# Altium project MY26 HV Inverter Logic Board.PrjPcb (part 3 of 3)

## Sheet PeripheralConnector.SchDoc
size A; SheetNumber: 12; SheetTotal: 15
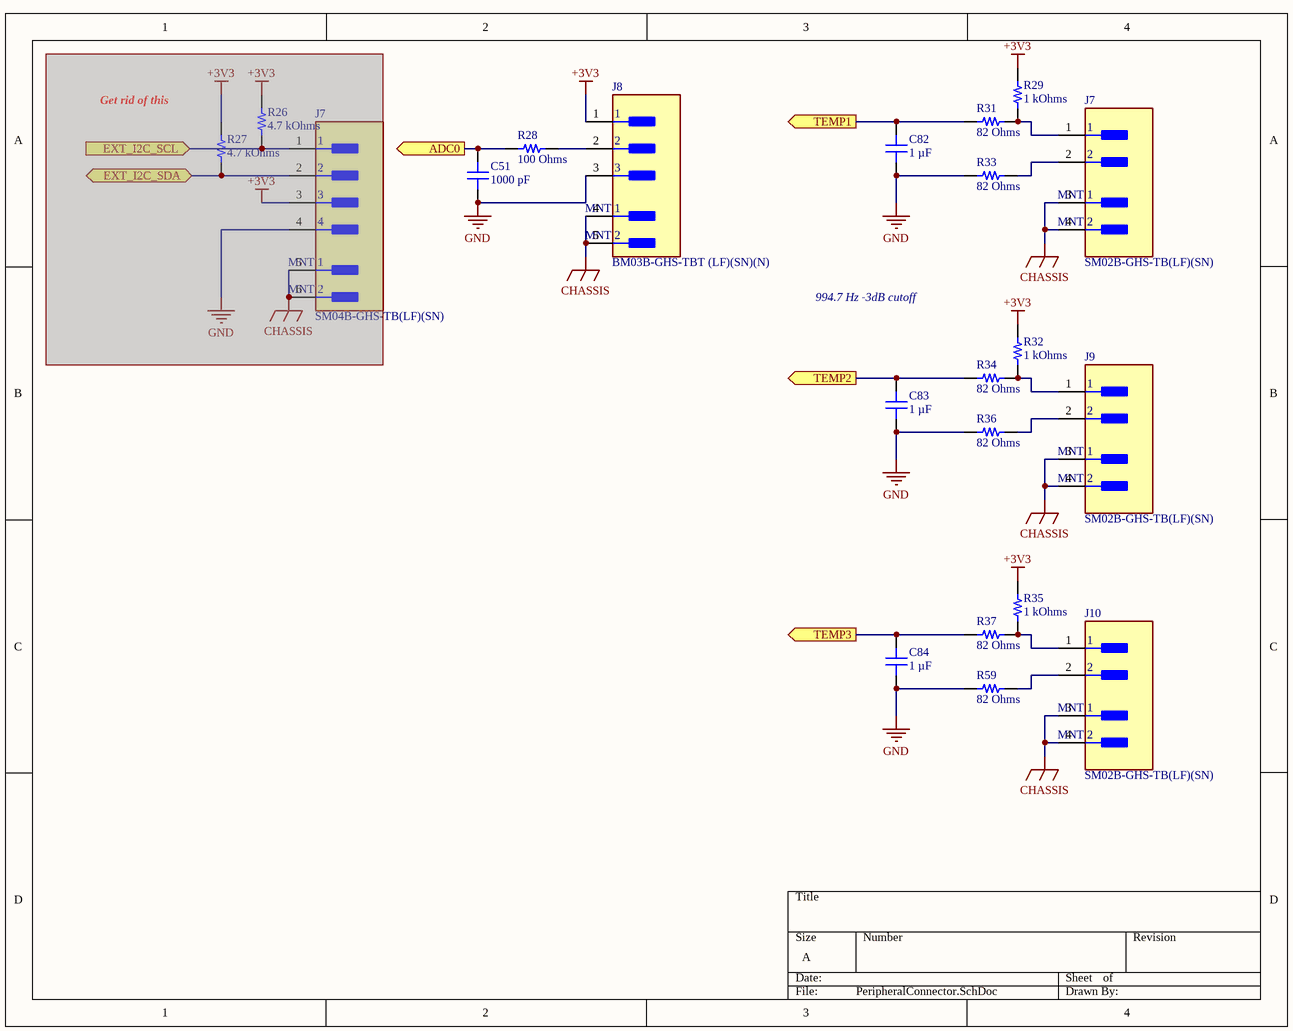
[diagram p10: PeripheralConnector.SchDoc]

### Parts
(Parts that share a designator on the sheet are numbered #1, #2 ... from top to bottom, then left to right.)
C51  1000 pF  [CAP 0402_1005]
C82  1 µF  [CAP 0402_1005]
C83  1 µF  [CAP 0402_1005]
C84  1 µF  [CAP 0402_1005]
J7#1  SM02B-GHS-TB(LF)(SN)  [FP-SM02B-GHS-TB_LF_SN-MFG]
J7#2  SM04B-GHS-TB(LF)(SN)  [FP-SM04B-GHS-TB_LF_SN-MFG]  (masked out: inside a compile mask, not in the netlist)
J8  BM03B-GHS-TBT (LF)(SN)(N)  [FP-BM03B-GHS-TBT_LF_SN-MFG]
J9  SM02B-GHS-TB(LF)(SN)  [FP-SM02B-GHS-TB_LF_SN-MFG]
J10  SM02B-GHS-TB(LF)(SN)  [FP-SM02B-GHS-TB_LF_SN-MFG]
R26#2  4.7 kOhms  [RES 0402_1005]  (masked out: inside a compile mask, not in the netlist)
R27#2  4.7 kOhms  [RES 0402_1005]  (masked out: inside a compile mask, not in the netlist)
R28  100 Ohms  [RES 0402_1005]
R29  1 kOhms  [RES 0402_1005]
R31  82 Ohms  [RES 0402_1005]
R32  1 kOhms  [RES 0402_1005]
R33  82 Ohms  [RES 0402_1005]
R34  82 Ohms  [RES 0402_1005]
R35  1 kOhms  [RES 0402_1005]
R36  82 Ohms  [RES 0402_1005]
R37  82 Ohms  [RES 0402_1005]
R59  82 Ohms  [RES 0402_1005]

### Ports
ADC0 (out), EXT_I2C_SCL (in), EXT_I2C_SDA (bidir), TEMP1 (out), TEMP2 (out), TEMP3 (out)

### Nets
+3V3: J8.1 R29.2 R32.2 R35.2
CHASSIS: J7#1.3(MNT_1) J7#1.4(MNT_2) J8.4(MNT_1) J8.5(MNT_2) J9.3(MNT_1) J9.4(MNT_2) J10.3(MNT_1) J10.4(MNT_2)
GND: C51.1 C82.1 C83.1 C84.1 J8.3 R33.1 R36.1 R59.1
ADC0: C51.2 R28.1 ; port ADC0
TEMP1: C82.2 R31.1 ; port TEMP1
TEMP2: C83.2 R34.1 ; port TEMP2
TEMP3: C84.2 R37.1 ; port TEMP3
NetJ7#1_1: J7#1.1 R29.1 R31.2
NetJ7#1_2: J7#1.2 R33.2
NetJ8_2: J8.2 R28.2
NetJ9_1: J9.1 R32.1 R34.2
NetJ9_2: J9.2 R36.2
NetJ10_1: J10.1 R35.1 R37.2
NetJ10_2: J10.2 R59.2

### Notes on the sheet
- (near R27#2) Get rid of this
- 994.7 Hz -3dB cutoff

### Library data of the parts
C51 = UMK105CG102JVHF: CAP CER 1000PF 50V C0G/NP0 0402; manufacturer: Taiyo Yuden; Temperature Coefficient: C0G, NP0; Tolerance: ±5%; Part Number: UMK105CG102JVHF; Capacitance: 1000 pF; Applications: Automotive; componentlink1description: Datasheet; componentlink1url: https://ds.yuden.co.jp/TYCOMPAS/ut/detail?pn=UMK105CG102JVHF &u=M; componentlink2description: DigiKey Link; componentlink2url: https://www.digikey.com/en/products/detail/taiyo-yuden/UMK105CG102JVHF/4811103; Device Package: 0402 (1005 Metric); lastupdated: 2/9/2024 8:04:38 PM; Lifecycle Status: Active; Minimum Order: 1; Mounting Type: Surface Mount, MLCC; Operating Temperature: -55°C ~ 125°C; Package / Case: 0402 (1005 Metric); packaging: TapeAndReel; partid: 1779; Part Status: Active; price: 0.01; Ratings: AEC-Q200; series: M; Size / Dimension: 0.039" L x 0.020" W (1.00mm x 0.50mm); Supplier 1: DigiKey; Supplier Part Number 1: 587-3737-1-ND; Thickness (Max): 0.022" (0.55mm); value: 1000 pF; Voltage - Rated: 50V
C82-C84 = 0402BW105K160NGT: CAP CER 1UF 16V X5R 0402; manufacturer: Knowles Novacap; Tolerance: ±10%; Part Number: 0402BW105K160NGT; Capacitance: 1 µF; Applications: General Purpose; componentlink1description: Datasheet; componentlink1url: https://www.knowlescapacitors.com/getattachment/6c8d48ef-fc2b-4752-ae2c-ce6c208de0c4/High-Capacitance-Chip.aspx; componentlink2description: DigiKey Link; componentlink2url: https://www.digikey.com/en/products/detail/knowles-novacap/0402BW105K160NGT/7304075; Device Package: 0402 (1005 Metric); Features: Gold Flash Termination; lastupdated: 2/9/2024 8:04:33 PM; Lifecycle Status: Active; Minimum Order: 1; Mounting Type: Surface Mount, MLCC; Operating Temperature: -55°C ~ 85°C; Package / Case: 0402 (1005 Metric); packaging: TapeAndReel; partid: 4314; Part Status: Active; price: 1.00; series: -; Size / Dimension: 0.040" L x 0.020" W (1.02mm x 0.51mm); Supplier 1: DigiKey; Supplier Part Number 1: 1763-1163-1-ND; Temperature Coefficient: X5R; Thickness (Max): 0.024" (0.61mm); value: 1 µF; Voltage - Rated: 16V
J7#1 J9 J10 = CMP-2000-07076-2: CONN HEADER SMD R/A 2POS 1.25MM; Voltage Rating: 50V; Number of Positions: 2; Pitch: 0.049inch; Current Rating: 1A; Connector Type: Outer Shroud Contact; Number of Rows: 1; Contact Material: Bronze; Termination: Solder; Color: Natural; Package Quantity: 2500; Mount: Surface Mount; Housing Color: Natural; Number of Contacts: 2; Packaging: Tape and Reel; Lead Free: Lead Free; Housing Material: Nylon; Orientation: Right Angle; Contact Type: Male Pin; Contact Plating: Tin; Series: GH; Fastening Type: Latch
J7#2 = CMP-17439-000411-1: CONN HEADER SMD R/A 4POS 1.25MM; Voltage Rating: 50V; Number of Contacts: 4; Current Rating: 1A; Termination: Solder; Mount: Surface Mount; REACH SVHC: No SVHC; Packaging: Cut Tape; Contact Material: Bronze; Series: GH; Orientation: Right Angle; Lead Free: Lead Free; Housing Material: Nylon; Contact Plating: Tin; Housing Color: Natural; Number of Rows: 1; Pitch: 1.25mm; Number of Positions: 4
J8 = CMP-17439-000616-1: CONN HEADER SMD 3POS 1.25MM; Mated Stacking Heights: 7.3mm; Voltage Rating: 50V; Pitch: 0.049inch; Number of Positions: 3; Contact Material: Bronze; Number of Rows: 1; Packaging: Cut Tape; Fastening Type: Ramp; Contact Shape: Rectangular; Termination: Solder; Flammability Rating: UL94 V-0; Lead Free: Lead Free; Color: Natural; Mount: Surface Mount; Contact Finish - Mating: TIN; Max Operating Temperature: 85°C; Series: GH; Insulation Color: Natural; Connector Type: Header; Insulation Material: Nylon; Contact Type: Outer Shroud Contact; Min Operating Temperature: -25°C; Contact Plating: Tin
R26#2 R27#2 = WR04X4701FTL: RES 4.7K OHM 1% 1/16W 0402; Manufacturer: Walsin Technology Corporation; Power (Watts): 0.063W, 1/16W; Temperature Coefficient: ±100ppm/°C; Part Number: WR04X4701FTL; Value: 4.7 kOhms; ComponentLink1Description: Datasheet; ComponentLink1URL: https://www.passivecomponent.com/wp-content/uploads/chipR/ASC_WR.pdf; ComponentLink2Description: DigiKey Link; ComponentLink2URL: https://www.digikey.com/en/products/detail/walsin-technology-corporation/WR04X4701FTL/13239186; Composition: Thick Film; Device Package: 0402 (1005 Metric); Height - Seated (Max): 0.016" (0.40mm); LastUpdated: 2/9/2024 8:28:34 PM; Lifecycle Status: Active; Minimum Order: 1; Number of Terminations: 2; Operating Temperature: -55°C ~ 155°C; Package / Case: 0402 (1005 Metric); Packaging: CutTape; PartId: 77487; Part Status: Active; Price: 0.01; Resistance: 4.7 kOhms; Series: WR; Size / Dimension: 0.039" L x 0.020" W (1.00mm x 0.50mm); Supplier 1: DigiKey; Supplier Part Number 1: 1292-WR04X4701FTLCT-ND; Supplier Device Package: 0402; Tolerance: ±1%
R28 = WR04X1000FTL: RES 100 OHM 1% 1/16W 0402; Manufacturer: Walsin Technology Corporation; Power (Watts): 0.063W, 1/16W; Temperature Coefficient: ±100ppm/°C; Part Number: WR04X1000FTL; Value: 100 Ohms; ComponentLink1Description: Datasheet; ComponentLink1URL: https://www.passivecomponent.com/wp-content/uploads/chipR/ASC_WR.pdf; ComponentLink2Description: DigiKey Link; ComponentLink2URL: https://www.digikey.com/en/products/detail/walsin-technology-corporation/WR04X1000FTL/13241075; Composition: Thick Film; Device Package: 0402 (1005 Metric); Height - Seated (Max): 0.016" (0.40mm); LastUpdated: 2/9/2024 8:28:55 PM; Lifecycle Status: Active; Minimum Order: 1; Number of Terminations: 2; Operating Temperature: -55°C ~ 155°C; Package / Case: 0402 (1005 Metric); Packaging: CutTape; PartId: 64787; Part Status: Active; Price: 0.01; Resistance: 100 Ohms; Series: WR; Size / Dimension: 0.039" L x 0.020" W (1.00mm x 0.50mm); Supplier 1: DigiKey; Supplier Part Number 1: 1292-WR04X1000FTLCT-ND; Supplier Device Package: 0402; Tolerance: ±1%
R29 R32 R35 = WR04X1001FTL: RES 1K OHM 1% 1/16W 0402; Manufacturer: Walsin Technology Corporation; Power (Watts): 0.063W, 1/16W; Temperature Coefficient: ±100ppm/°C; Part Number: WR04X1001FTL; Value: 1 kOhms; ComponentLink1Description: Datasheet; ComponentLink1URL: https://www.passivecomponent.com/wp-content/uploads/chipR/ASC_WR.pdf; ComponentLink2Description: DigiKey Link; ComponentLink2URL: https://www.digikey.com/en/products/detail/walsin-technology-corporation/WR04X1001FTL/13240628; Composition: Thick Film; Device Package: 0402 (1005 Metric); Height - Seated (Max): 0.016" (0.40mm); LastUpdated: 2/9/2024 8:28:55 PM; Lifecycle Status: Active; Minimum Order: 1; Number of Terminations: 2; Operating Temperature: -55°C ~ 155°C; Package / Case: 0402 (1005 Metric); Packaging: CutTape; PartId: 64768; Part Status: Active; Price: 0.01; Resistance: 1 kOhms; Series: WR; Size / Dimension: 0.039" L x 0.020" W (1.00mm x 0.50mm); Supplier 1: DigiKey; Supplier Part Number 1: 1292-WR04X1001FTLCT-ND; Supplier Device Package: 0402; Tolerance: ±1%
R31 R33 R34 R36 R37 R59 = ERJ-2GEJ820X: RES SMD 82 OHM 5% 1/10W 0402; Manufacturer: Panasonic Electronic Components; Power (Watts): 0.1W, 1/10W; Temperature Coefficient: ±200ppm/°C; Part Number: ERJ-2GEJ820X; Value: 82 Ohms; ComponentLink1Description: Datasheet; ComponentLink1URL: https://b2b-api.panasonic.eu/file_stream/pids/fileversion/1242; ComponentLink2Description: DigiKey Link; ComponentLink2URL: https://www.digikey.com/en/products/detail/panasonic-electronic-components/ERJ-2GEJ820X/147082; Composition: Thick Film; Device Package: 0402 (1005 Metric); Features: Automotive AEC-Q200; Height - Seated (Max): 0.016" (0.40mm); LastUpdated: 2/9/2024 8:30:20 PM; Lifecycle Status: Active; Minimum Order: 1; Number of Terminations: 2; Operating Temperature: -55°C ~ 155°C; Package / Case: 0402 (1005 Metric); Packaging: CutTape; PartId: 3514; Part Status: Active; Price: 0.01; Ratings: AEC-Q200; Resistance: 82 Ohms; Series: ERJ-2G; Size / Dimension: 0.039" L x 0.020" W (1.00mm x 0.50mm); Supplier 1: DigiKey; Supplier Part Number 1: P82JCT-ND; Supplier Device Package: 0402; Tolerance: ±5%

## Sheet EXTADC.SchDoc
size A; SheetNumber: 13; SheetTotal: 15
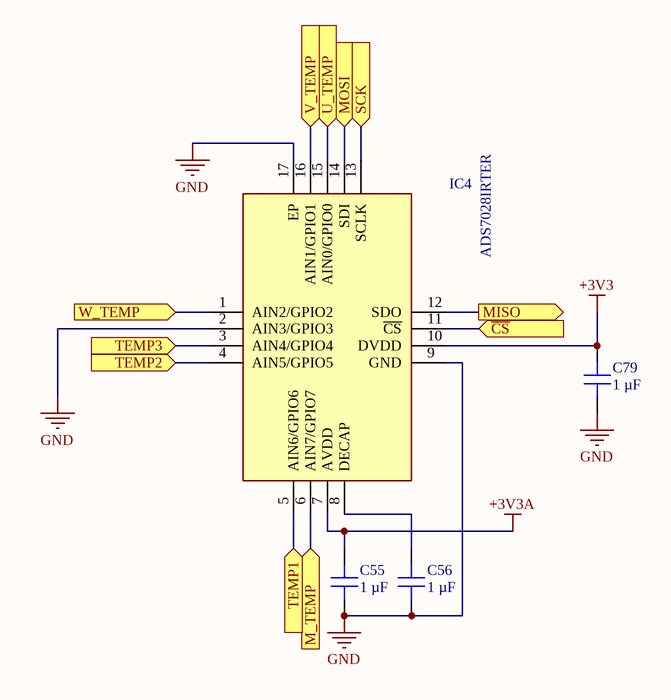
[diagram p11: EXTADC.SchDoc]

### Parts
C55  1 µF  [MURATA GRM155 0402_1005]
C56  1 µF  [MURATA GRM155 0402_1005]
C79  1 µF  [MURATA GRM155 0402_1005]
IC4  ADS7028IRTER  [QFN50P300X300X80-17N-D]

### Ports
M_TEMP (in), MISO (out), MOSI (in), SCK (in), TEMP1 (in), TEMP2 (in), TEMP3 (in), U_TEMP (in), V_TEMP (in), W_TEMP (in), ~{CS} (in)

### Nets
+3V3: C79.2 IC4.10(DVDD)
+3V3A: C55.2 IC4.7(AVDD)
GND: C55.1 C56.1 C79.1 IC4.2(AIN3/GPIO3) IC4.9(GND) IC4.17(EP)
ADC_CLK: IC4.13(SCLK) ; port SCK
ADC_CS: IC4.11(~{CS}) ; port ~{CS}
ADC_MISO: IC4.12(SDO) ; port MISO
ADC_MOSI: IC4.14(SDI) ; port MOSI
M_TEMP: IC4.6(AIN7/GPIO7) ; port M_TEMP
TEMP1: IC4.5(AIN6/GPIO6) ; port TEMP1
TEMP2: IC4.4(AIN5/GPIO5) ; port TEMP2
TEMP3: IC4.3(AIN4/GPIO4) ; port TEMP3
U_TEMP: IC4.15(AIN0/GPIO0) ; port U_TEMP
V_TEMP: IC4.16(AIN1/GPIO1) ; port V_TEMP
W_TEMP: IC4.1(AIN2/GPIO2) ; port W_TEMP
NetC56_2: C56.2 IC4.8(DECAP)

### Library data of the parts
C55 C56 C79 = GRM155C71A105KE11D: CAP CER 1UF 10V X7S 0402; manufacturer: Murata Electronics; Tolerance: ±10%; Part Number: GRM155C71A105KE11D; Capacitance: 1 µF; Applications: General Purpose; componentlink1description: Datasheet; componentlink1url: https://search.murata.co.jp/Ceramy/image/img/A01X/G101/ENG/GRM155C71A105KE11-01.pdf; componentlink2description: DigiKey Link; componentlink2url: https://www.digikey.com/en/products/detail/murata-electronics/GRM155C71A105KE11D/6606086; Device Package: 0402 (1005 Metric); lastupdated: 7/23/2025 10:42:36 AM; Lifecycle Status: Active; Minimum Order: 1; Mounting Type: Surface Mount, MLCC; Operating Temperature: -55°C ~ 125°C; Package / Case: 0402 (1005 Metric); packaging: TapeAndReel; partid: 1749; Part Status: Active; price: 0.01; series: GRM; Size / Dimension: 0.039" L x 0.020" W (1.00mm x 0.50mm); Supplier 1: DigiKey; Supplier Part Number 1: 490-14457-1-ND; Temperature Coefficient: X7S; Thickness (Max): 0.024" (0.60mm); value: 1 µF; Voltage - Rated: 10V
IC4 = ADS7028IRTER: Integrated Circuit; Manufacturer_Name: Texas Instruments; Datasheet Link: https://www.arrow.com/en/products/ads7028irter/texas-instruments; Height: 0.8mm; Manufacturer_Part_Number: ADS7028IRTER; Mouser Part Number: 595-ADS7028IRTER; Mouser Price/Stock: https://www.mouser.co.uk/ProductDetail/Texas-Instruments/ADS7028IRTER?qs=%252B6g0mu59x7L0mzHBJBWvJw%3D%3D; Arrow Part Number: ADS7028IRTER; Arrow Price/Stock: https://www.arrow.com/en/products/ads7028irter/texas-instruments

## Sheet EnDat.SchDoc
size A; SheetNumber: 11; SheetTotal: 15
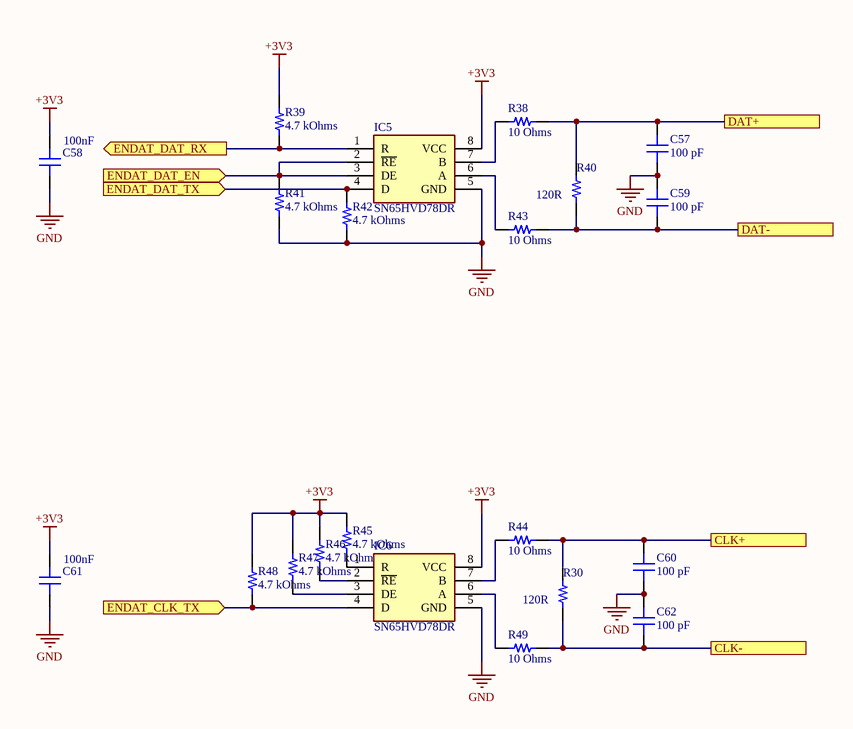
[diagram p12: EnDat.SchDoc]

### Parts
C57  100 pF  [CAP 0402_1005]
C58  100nF  [CAP 0402_1005]
C59  100 pF  [CAP 0402_1005]
C60  100 pF  [CAP 0402_1005]
C61  100nF  [CAP 0402_1005]
C62  100 pF  [CAP 0402_1005]
IC5  SN65HVD78DR  [SOIC127P600X175-8N]
IC6  SN65HVD78DR  [SOIC127P600X175-8N]
R30  120R  [RES 0603_1608]
R38  10 Ohms  [RES 0402_1005]
R39  4.7 kOhms  [RES 0402_1005]
R40  120R  [RES 0603_1608]
R41  4.7 kOhms  [RES 0402_1005]
R42  4.7 kOhms  [RES 0402_1005]
R43  10 Ohms  [RES 0402_1005]
R44  10 Ohms  [RES 0402_1005]
R45  4.7 kOhms  [RES 0402_1005]
R46  4.7 kOhms  [RES 0402_1005]
R47  4.7 kOhms  [RES 0402_1005]
R48  4.7 kOhms  [RES 0402_1005]
R49  10 Ohms  [RES 0402_1005]

### Ports
CLK+, CLK-, DAT+, DAT-, ENDAT_CLK_TX (in), ENDAT_DAT_EN (in), ENDAT_DAT_RX (out), ENDAT_DAT_TX (in)

### Nets
+3V3: C58.2 C61.2 IC5.8(VCC) IC6.8(VCC) R39.2 R45.2 R46.2 R47.2 R48.2
GND: C57.1 C58.1 C59.2 C60.1 C61.1 C62.2 IC5.5(GND) IC6.5(GND) R41.1 R42.1
CLK+: C60.2 R30.2 R44.2 ; port CLK+
CLK-: C62.1 R30.1 R49.2 ; port CLK-
DAT+: C57.2 R38.2 R40.2 ; port DAT+
DAT-: C59.1 R40.1 R43.2 ; port DAT-
ENC_CLK: IC6.4(D) R48.1 ; port ENDAT_CLK_TX
ENC_ENDAT: IC5.2(~{RE}) IC5.3(DE) R41.2 ; port ENDAT_DAT_EN
ENC_MISO: IC5.1(R) R39.1 ; port ENDAT_DAT_RX
ENC_MOSI: IC5.4(D) R42.2 ; port ENDAT_DAT_TX
NetIC5_6: IC5.6(A) R43.1
NetIC5_7: IC5.7(B) R38.1
NetIC6_1: IC6.1(R) R45.1
NetIC6_2: IC6.2(~{RE}) R46.1
NetIC6_3: IC6.3(DE) R47.1
NetIC6_6: IC6.6(A) R49.1
NetIC6_7: IC6.7(B) R44.1

### Library data of the parts
C57 C59 C60 C62 = 500X07N101MV4T: CAP CER 100PF 50V C0G/NP0 0402; manufacturer: Johanson Dielectrics Inc.; Temperature Coefficient: C0G, NP0; Tolerance: ±20%; Part Number: 500X07N101MV4T; Capacitance: 100 pF; Applications: Bypass, Decoupling; componentlink1description: Datasheet; componentlink1url: https://www.johansondielectrics.com/downloads/x2y-filter-and-decoupling-capacitors.pdf; componentlink2description: DigiKey Link; componentlink2url: https://www.digikey.com/en/products/detail/johanson-dielectrics-inc/500X07N101MV4T/2046917; Device Package: 0402 (1005 Metric); Features: Low ESL (X2Y); lastupdated: 2/9/2024 8:04:38 PM; Lifecycle Status: Active; Minimum Order: 1; Mounting Type: Surface Mount, MLCC; Operating Temperature: -55°C ~ 125°C; Package / Case: 0402 (1005 Metric); packaging: TapeAndReel; partid: 1767; Part Status: Active; price: 0.08; series: X2Y®; Size / Dimension: 0.045" L x 0.025" W (1.14mm x 0.64mm); Supplier 1: DigiKey; Supplier Part Number 1: 709-1214-1-ND; Thickness (Max): 0.020" (0.51mm); value: 100 pF; Voltage - Rated: 50V
C58 C61 = CL05A105KO5NNNC: CAP CER 1UF 16V X5R 0402; Part Number: C29266; manufacturer: Samsung Electro-Mechanics; Capacitance: 10uF; Tolerance: ±10%; value: 1 µF; Applications: General Purpose; componentlink1description: Datasheet; componentlink1url: http://www.samsungsem.com/kr/support/product-search/mlcc/CL05A105KO5NNNC.jsp; componentlink2description: DigiKey Link; componentlink2url: https://www.digikey.com/en/products/detail/samsung-electro-mechanics/CL05A105KO5NNNC/3886725; Device Package: 0402 (1005 Metric); lastupdated: 2/9/2024 8:04:35 PM; Lifecycle Status: Active; Minimum Order: 1; Mounting Type: Surface Mount, MLCC; Operating Temperature: -55°C ~ 85°C; Package / Case: 0402 (1005 Metric); packaging: TapeAndReel; partid: 3120; Part Status: Active; price: 0.01; series: CL; Size / Dimension: 0.039" L x 0.020" W (1.00mm x 0.50mm); Supplier 1: DigiKey; Supplier Part Number 1: 1276-1067-1-ND; Temperature Coefficient: X5R; Thickness (Max): 0.022" (0.55mm); Voltage - Rated: 16V
IC5 IC6 = SN65HVD78DR: Integrated Circuit; Manufacturer_Name: Texas Instruments; Datasheet Link: http://www.ti.com/lit/gpn/sn65hvd78; Height: 1.75mm; Manufacturer_Part_Number: SN65HVD78DR; Mouser Part Number: 595-SN65HVD78DR; Mouser Price/Stock: https://www.mouser.co.uk/ProductDetail/Texas-Instruments/SN65HVD78DR?qs=GIZt7gVh5wSQImLM3RD5ag%3D%3D; Arrow Part Number: SN65HVD78DR; Arrow Price/Stock: https://www.arrow.com/en/products/sn65hvd78dr/texas-instruments?region=nac
R30 R40 = CR0603AFX-10R0EAS: RESA-AS 0603 10R 1% 100MW TC100; Manufacturer: Bourns Inc.; Value: 510R; Power (Watts): 0.1W, 1/10W; Resistance: 10 Ohms; Temperature Coefficient: ±100ppm/°C; Part Number: CR0603AFX-10R0EAS; ComponentLink1Description: Datasheet; ComponentLink1URL: //media.digikey.com/pdf/Data%20Sheets/Bourns%20PDFs/CRyyyyA-AS_Model_DS.pdf; ComponentLink2Description: DigiKey Link; ComponentLink2URL: https://www.digikey.com/en/products/detail/bourns-inc/CR0603AFX-10R0EAS/10240119; Composition: Thick Film; Device Package: 0603 (1608 Metric); Features: Anti-Sulfur, Automotive AEC-Q200, Moisture Resistant; Height - Seated (Max): 0.022" (0.55mm); LastUpdated: 2/9/2024 8:42:17 PM; Lifecycle Status: Active; Minimum Order: 1; Number of Terminations: 2; Operating Temperature: -55°C ~ 155°C; Package / Case: 0603 (1608 Metric); Packaging: TapeAndReel; PartId: 23787; Part Status: Active; Price: 0.01; Ratings: AEC-Q200; Series: CR0603A-AS; Size / Dimension: 0.063" L x 0.031" W (1.60mm x 0.80mm); Supplier 1: DigiKey; Supplier Part Number 1: CR0603AFX-10R0EASCT-ND; Supplier Device Package: 0603; Tolerance: ±1%
R38 R43 R44 R49 = WR04X100 JTL: RES 10 OHM 5% 1/16W 0402; Manufacturer: Walsin Technology Corporation; Power (Watts): 0.063W, 1/16W; Temperature Coefficient: -200/ +400ppm/°C; Part Number: WR04X100 JTL; Value: 10 Ohms; ComponentLink1Description: Datasheet; ComponentLink1URL: https://www.passivecomponent.com/wp-content/uploads/chipR/ASC_WR.pdf; ComponentLink2Description: DigiKey Link; ComponentLink2URL: https://www.digikey.com/en/products/detail/walsin-technology-corporation/WR04X100-JTL/13241174; Composition: Thick Film; Device Package: 0402 (1005 Metric); Height - Seated (Max): 0.016" (0.40mm); LastUpdated: 2/9/2024 8:28:55 PM; Lifecycle Status: Active; Minimum Order: 1; Number of Terminations: 2; Operating Temperature: -55°C ~ 155°C; Package / Case: 0402 (1005 Metric); Packaging: CutTape; PartId: 64776; Part Status: Active; Price: 0.01; Resistance: 10 Ohms; Series: WR; Size / Dimension: 0.039" L x 0.020" W (1.00mm x 0.50mm); Supplier 1: DigiKey; Supplier Part Number 1: 1292-WR04X100JTLCT-ND; Supplier Device Package: 0402; Tolerance: ±5%
R39 R41 R42 R45-R48 = WR04X4701FTL: as R26#2 on sheet PeripheralConnector; Part Number: WR04X4701FTL; Value: 4.7 kOhms; ComponentLink1Description: Datasheet; ComponentLink1URL: https://www.passivecomponent.com/wp-content/uploads/chipR/ASC_WR.pdf; ComponentLink2Description: DigiKey Link; ComponentLink2URL: https://www.digikey.com/en/products/detail/walsin-technology-corporation/WR04X4701FTL/13239186; Composition: Thick Film; Device Package: 0402 (1005 Metric); Height - Seated (Max): 0.016" (0.40mm); LastUpdated: 2/9/2024 8:28:34 PM; Lifecycle Status: Active; Minimum Order: 1; Number of Terminations: 2; Operating Temperature: -55°C ~ 155°C; Package / Case: 0402 (1005 Metric); Packaging: CutTape; PartId: 77487; Part Status: Active; Price: 0.01; Resistance: 4.7 kOhms; Series: WR; Size / Dimension: 0.039" L x 0.020" W (1.00mm x 0.50mm); Supplier 1: DigiKey; Supplier Part Number 1: 1292-WR04X4701FTLCT-ND; Supplier Device Package: 0402; Tolerance: ±1%

## Sheet FaultDet.SchDoc
size A; SheetNumber: 14; SheetTotal: 15
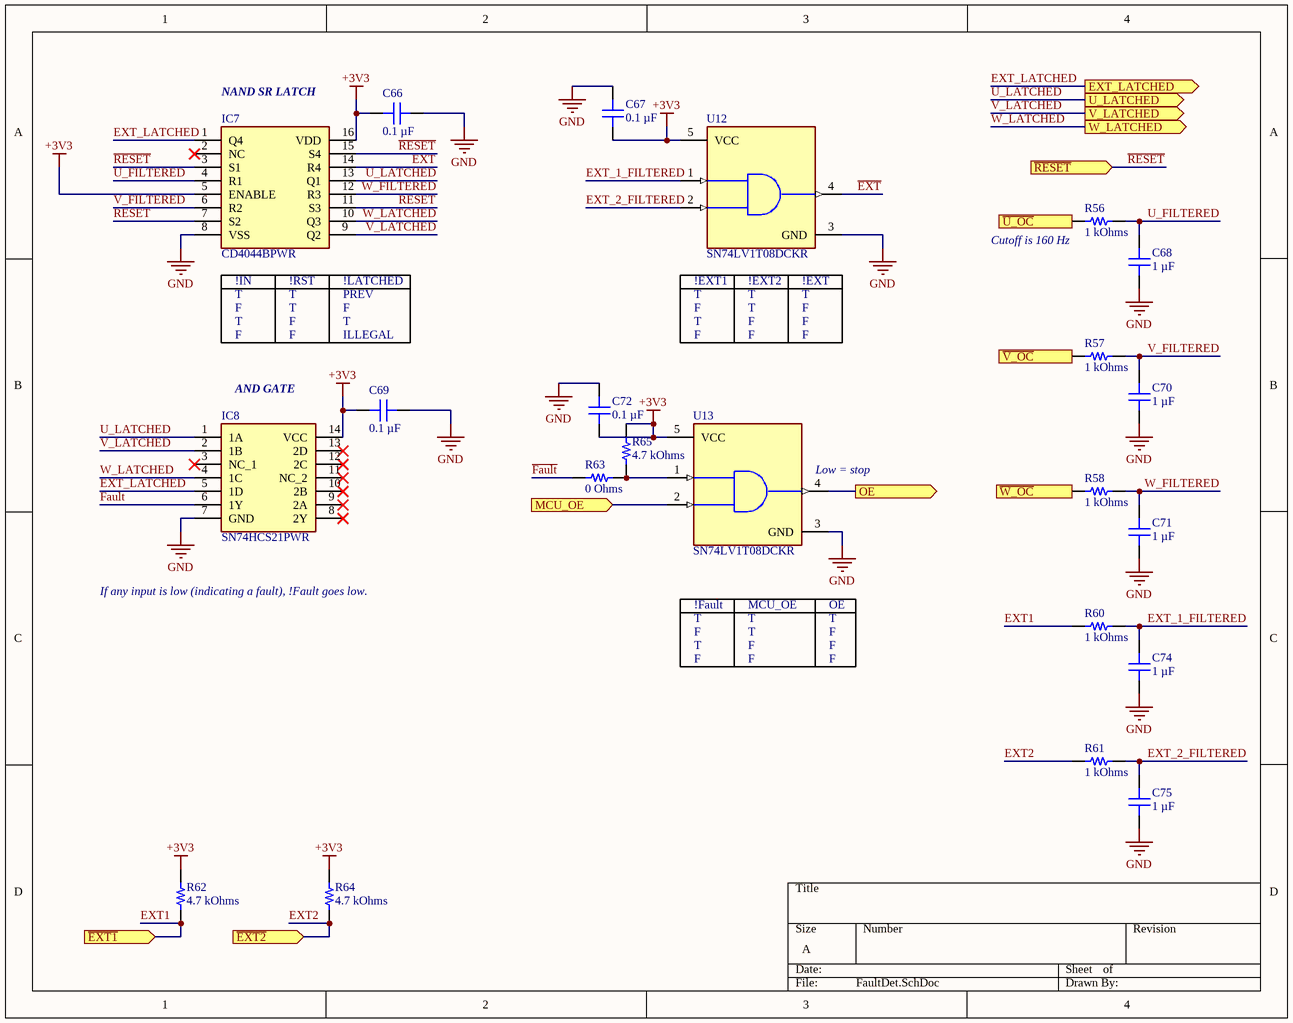
[diagram p13: FaultDet.SchDoc]

### Parts
C66  0.1 µF  [CAP 0402_1005]
C67  0.1 µF  [CAP 0402_1005]
C68  1 µF  [MURATA GRM155 0402_1005]
C69  0.1 µF  [CAP 0402_1005]
C70  1 µF  [MURATA GRM155 0402_1005]
C71  1 µF  [MURATA GRM155 0402_1005]
C72  0.1 µF  [CAP 0402_1005]
C74  1 µF  [MURATA GRM155 0402_1005]
C75  1 µF  [MURATA GRM155 0402_1005]
IC7  CD4044BPWR  [SOP65P640X120-16N]
IC8  SN74HCS21PWR  [SOP65P640X120-14N]
R56  1 kOhms  [YAGEO RES 0402_1005]
R57  1 kOhms  [YAGEO RES 0402_1005]
R58  1 kOhms  [YAGEO RES 0402_1005]
R60  1 kOhms  [YAGEO RES 0402_1005]
R61  1 kOhms  [YAGEO RES 0402_1005]
R62  4.7 kOhms  [YAGEO RES 0402_1005]
R63  0 Ohms  [RES 0402_1005]
R64  4.7 kOhms  [YAGEO RES 0402_1005]
R65  4.7 kOhms  [YAGEO RES 0402_1005]
U12  SN74LV1T08DCKR  [FP-DCK0005A-IPC_C]
U13  SN74LV1T08DCKR  [FP-DCK0005A-IPC_C]

### Ports
EXT_LATCHED (out), MCU_OE (in), OE (out), U_LATCHED (out), V_LATCHED (out), W_LATCHED (out), ~{EXT1} (in), ~{EXT2} (in), ~{RESET} (in), ~{U_OC} (in), ~{V_OC} (in), ~{W_OC} (in)

### Nets
+3V3: C66.2 C67.1 C69.2 C72.1 IC7.5(ENABLE) IC7.16(VDD) IC8.14(VCC) R62.2 R64.2 R65.2 U12.5(VCC) U13.5(VCC)
GND: C66.1 C67.2 C68.1 C69.1 C70.1 C71.1 C72.2 C74.1 C75.1 IC7.8(VSS) IC8.7(GND) U12.3(GND) U13.3(GND)
~{EXT}: IC7.14(R4) U12.4(Y)  [project net ~{EXT}_14]
EXT1: R60.1 R62.1 ; port ~{EXT1}  [project net EXT_FAULT_1]
EXT2: R61.1 R64.1 ; port ~{EXT2}  [project net EXT_FAULT_2]
EXT_1_FILTERED: C74.2 R60.2 U12.1(A)  [project net EXT_1_FILTERED_14]
EXT_2_FILTERED: C75.2 R61.2 U12.2(B)  [project net EXT_2_FILTERED_14]
EXT_LATCHED: IC7.1(Q4) IC8.5(1D) ; port EXT_LATCHED  [project net EXT_FAULT]
~{Fault}: IC8.6(1Y) R63.1  [project net ~{Fault}_14]
OE: U13.2(B) ; port MCU_OE
~{RESET}: IC7.3(S1) IC7.7(S2) IC7.11(S3) IC7.15(S4) ; port ~{RESET}  [project net FAULT_RST]
U_EN: U13.4(Y) ; port OE
U_FILTERED: C68.2 IC7.4(R1) R56.2  [project net U_FILTERED_14]
U_LATCHED: IC7.13(Q1) IC8.1(1A) ; port U_LATCHED
U_OC: R56.1 ; port ~{U_OC}
V_FILTERED: C70.2 IC7.6(R2) R57.2  [project net V_FILTERED_14]
V_LATCHED: IC7.9(Q2) IC8.2(1B) ; port V_LATCHED
V_OC: R57.1 ; port ~{V_OC}
W_FILTERED: C71.2 IC7.12(R3) R58.2  [project net W_FILTERED_14]
W_LATCHED: IC7.10(Q3) IC8.4(1C) ; port W_LATCHED
W_OC: R58.1 ; port ~{W_OC}
NetR63_2: R63.2 R65.1 U13.1(A)

Not connected (* = marked no-connect by the designer): IC7 2(NC)*; IC8 3(NC_1)* 8(2Y)* 9(2A)* 10(2B)* 11(NC_2)* 12(2C)* 13(2D)*

### Notes on the sheet
- (near IC7) NAND SR LATCH
- (near IC7) !IN
- T
- (near IC7) !RST
- (near IC7) !LATCHED
- PREV
- (near U12) !EXT1
- (near U12) !EXT2
- (near U12) !EXT
- (near R56) Cutoff is 160 Hz
- F
- ILLEGAL
- (near IC8) AND GATE
- (near U13) Low = stop
- If any input is low (indicating a fault), !Fault goes low.
- !Fault
- MCU_OE
- OE

### Library data of the parts
C66 C67 C69 C72 = C0402C104K4RECAUTO: CAP CER 0402 0.1UF 16V X7R 10%; manufacturer: KEMET; Part Number: C0402C104K4RECAUTO; Capacitance: 0.1 µF; Applications: Automotive, ESD Protection; componentlink1description: Datasheet; componentlink1url: https://api.kemet.com/component-edge/download/datasheet/C0402C104K4RECAUTO.pdf; componentlink2description: DigiKey Link; componentlink2url: https://www.digikey.com/en/products/detail/kemet/C0402C104K4RECAUTO/8563695; Device Package: 0402 (1005 Metric); lastupdated: 2/9/2024 8:04:38 PM; Lifecycle Status: Active; Minimum Order: 1; Mounting Type: Surface Mount, MLCC; Operating Temperature: -55°C ~ 125°C; Package / Case: 0402 (1005 Metric); packaging: TapeAndReel; partid: 1731; Part Status: Active; price: 0.01; Ratings: AEC-Q200; series: ESD SMD Auto X7R; Size / Dimension: 0.039" L x 0.020" W (1.00mm x 0.50mm); Supplier 1: DigiKey; Supplier Part Number 1: 399-17167-1-ND; Temperature Coefficient: X7R; Thickness (Max): 0.022" (0.55mm); Tolerance: ±10%; value: 0.1 µF; Voltage - Rated: 16V
C68 C70 C71 C74 C75 = GRM155C71A105KE11D: as C55 on sheet EXTADC; Part Number: GRM155C71A105KE11D; Capacitance: 1 µF; Applications: General Purpose; componentlink1description: Datasheet; componentlink1url: https://search.murata.co.jp/Ceramy/image/img/A01X/G101/ENG/GRM155C71A105KE11-01.pdf; componentlink2description: DigiKey Link; componentlink2url: https://www.digikey.com/en/products/detail/murata-electronics/GRM155C71A105KE11D/6606086; Device Package: 0402 (1005 Metric); lastupdated: 7/23/2025 10:42:36 AM; Lifecycle Status: Active; Minimum Order: 1; Mounting Type: Surface Mount, MLCC; Operating Temperature: -55°C ~ 125°C; Package / Case: 0402 (1005 Metric); packaging: TapeAndReel; partid: 1749; Part Status: Active; price: 0.01; series: GRM; Size / Dimension: 0.039" L x 0.020" W (1.00mm x 0.50mm); Supplier 1: DigiKey; Supplier Part Number 1: 490-14457-1-ND; Temperature Coefficient: X7S; Thickness (Max): 0.024" (0.60mm); value: 1 µF; Voltage - Rated: 10V
IC7 = CD4044BPWR: Integrated Circuit; Manufacturer_Name: Texas Instruments; Datasheet Link: http://www.ti.com/lit/gpn/cd4044b; Height: 1.2mm; Manufacturer_Part_Number: CD4044BPWR; Mouser Part Number: 595-CD4044BPWR; Mouser Price/Stock: https://www.mouser.co.uk/ProductDetail/Texas-Instruments/CD4044BPWR?qs=LSR%252BNeaw%2FwA0JC88gEuhWQ%3D%3D; Arrow Part Number: CD4044BPWR; Arrow Price/Stock: https://www.arrow.com/en/products/cd4044bpwr/texas-instruments?utm_currency=USD&region=nac
IC8 = SN74HCS21PWR: Integrated Circuit; Manufacturer_Name: Texas Instruments; Datasheet Link: https://www.ti.com/lit/gpn/SN74HCS21; Height: 1.2mm; Manufacturer_Part_Number: SN74HCS21PWR; Mouser Part Number: 595-SN74HCS21PWR; Mouser Price/Stock: https://www.mouser.co.uk/ProductDetail/Texas-Instruments/SN74HCS21PWR?qs=GedFDFLaBXETYHCH97WONA%3D%3D; Arrow Part Number: SN74HCS21PWR; Arrow Price/Stock: https://www.arrow.com/en/products/sn74hcs21pwr/texas-instruments?region=nac
R56-R58 R60 R61 = AT0402BRD071KL: RES SMD 1K OHM 0.1% 1/16W 0402; Manufacturer: Yageo; Power (Watts): 0.063W, 1/16W; Temperature Coefficient: ±25ppm/°C; Part Number: AT0402BRD071KL; Value: 1 kOhms; ComponentLink1Description: Datasheet; ComponentLink1URL: http://www.yageo.com/documents/recent/PYu-AT_51_RoHS_L_5.pdf; ComponentLink2Description: DigiKey Link; ComponentLink2URL: https://www.digikey.com/en/products/detail/yageo/AT0402BRD071KL/5138607; Composition: Thin Film; Device Package: 0402 (1005 Metric); Features: Anti-Sulfur, Automotive AEC-Q200, Moisture Resistant; Height - Seated (Max): 0.014" (0.35mm); LastUpdated: 8/31/2025 3:04:18 PM; Lifecycle Status: Active; Minimum Order: 1; Number of Terminations: 2; Operating Temperature: -55°C ~ 155°C; Package / Case: 0402 (1005 Metric); Packaging: TapeAndReel; PartId: 2462; Part Status: Active; Price: 0.09; Ratings: AEC-Q200; Resistance: 1 kOhms; Series: AT; Size / Dimension: 0.039" L x 0.020" W (1.00mm x 0.50mm); Supplier 1: DigiKey; Supplier Part Number 1: YAG2088CT-ND; Supplier Device Package: 0402; Tolerance: ±0.1%
R62 R64 R65 = RT0402FRE074K7L: RES SMD 4.7K OHM 1% 1/16W 0402; Manufacturer: Yageo; Power (Watts): 0.063W, 1/16W; Temperature Coefficient: ±50ppm/°C; Part Number: RT0402FRE074K7L; Value: 4.7 kOhms; ComponentLink1Description: Datasheet; ComponentLink1URL: https://www.yageo.com/upload/media/product/productsearch/datasheet/rchip/PYu-RT_1-to-0.01_RoHS_L_11.pdf; ComponentLink2Description: DigiKey Link; ComponentLink2URL: https://www.digikey.com/en/products/detail/yageo/RT0402FRE074K7L/1072052; Composition: Thin Film; Device Package: 0402 (1005 Metric); Height - Seated (Max): 0.014" (0.35mm); LastUpdated: 8/31/2025 3:04:17 PM; Lifecycle Status: Active; Minimum Order: 1; Number of Terminations: 2; Operating Temperature: -55°C ~ 155°C; Package / Case: 0402 (1005 Metric); Packaging: TapeAndReel; PartId: 3198; Part Status: Active; Price: 0.01; Resistance: 4.7 kOhms; Series: RT; Size / Dimension: 0.039" L x 0.020" W (1.00mm x 0.50mm); Supplier 1: DigiKey; Supplier Part Number 1: YAG3347CT-ND; Supplier Device Package: 0402; Tolerance: ±1%
R63 = 5112: 0402 JUMPER ON TAPE AND REEL; Part Number: 5112; Manufacturer: Keystone Electronics; Power (Watts): 0.5W, 1/2W; Value: 0 Ohms; ComponentLink1Description: Datasheet; ComponentLink1URL: http://www.keystoneelectronics.net/ENG._DEPT/WEB_ORACLE/PDF/PDF%20CAT%20NO%20DRAWINGS/5000-5999/5112.PDF; ComponentLink2Description: DigiKey Link; ComponentLink2URL: https://www.digikey.com/en/products/detail/keystone-electronics/5112/9921836; Composition: Metal Element; Device Package: 0402 (1005 Metric); Height - Seated (Max): 0.020" (0.50mm); LastUpdated: 2/9/2024 8:29:48 PM; Lifecycle Status: Active; Minimum Order: 1; Number of Terminations: 2; Package / Case: 0402 (1005 Metric); Packaging: TapeAndReel; PartId: 12597; Part Status: Active; Price: 0.16; Resistance: 0 Ohms; Series: -; Size / Dimension: 0.039" L x 0.020" W (1.00mm x 0.50mm); Supplier 1: DigiKey; Supplier Part Number 1: 36-5112-1-ND; Supplier Device Package: 0402; Tolerance: Jumper
U12 U13 = CMP-0859-00360-4: IC GATE AND 1CH 2-INP SC70-5; Propagation Delay: 7ns; Number of Bits: 1; Number of Inputs: 2; Low Level Output Current: 8mA; Logic Function: AND GATE; Output Current: 25mA; Max Supply Voltage: 5.5V; Quiescent Current: 1uA; Min Supply Voltage: 1.8V; High Level Output Current: -8mA; Number of Gates: 1; Radiation Hardening: No; Min Operating Temperature: -40°C; Max Operating Temperature: 125°C; Package Quantity: 3000; Number of Circuits: 1; Contact Plating: Gold; RoHS Compliant: Yes; Lead Free: Lead Free; Number of Input Lines: 2; Number of Pins: 5; Weight: 0.000705oz; Packaging: Tape and Reel; Mount: Surface Mount

## Sheet Flash.SchDoc
size A; SheetNumber: 15; SheetTotal: 15
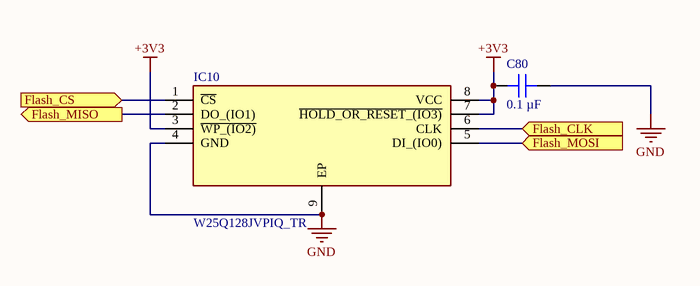
[diagram p14: Flash.SchDoc]

### Parts
C80  0.1 µF  [CAP 0402_1005]
IC10  W25Q128JVPIQ_TR  [SON127P600X500X80-9N-D]

### Ports
Flash_CLK (in), Flash_CS (in), Flash_MISO (out), Flash_MOSI (in)

### Nets
+3V3: C80.1 IC10.3(~{WP_(IO2)}) IC10.7(~{HOLD_OR_RESET_(IO3)}) IC10.8(VCC)
GND: C80.2 IC10.4(GND) IC10.9(EP)
FLASH_CLK: IC10.6(CLK) ; port Flash_CLK
FLASH_CS: IC10.1(~{CS}) ; port Flash_CS
FLASH_MISO: IC10.2(DO_(IO1)) ; port Flash_MISO
FLASH_MOSI: IC10.5(DI_(IO0)) ; port Flash_MOSI

### Library data of the parts
C80 = C0402C104K4RECAUTO: as C66 on sheet FaultDet; Part Number: C0402C104K4RECAUTO; Capacitance: 0.1 µF; Applications: Automotive, ESD Protection; componentlink1description: Datasheet; componentlink1url: https://api.kemet.com/component-edge/download/datasheet/C0402C104K4RECAUTO.pdf; componentlink2description: DigiKey Link; componentlink2url: https://www.digikey.com/en/products/detail/kemet/C0402C104K4RECAUTO/8563695; Device Package: 0402 (1005 Metric); lastupdated: 2/9/2024 8:04:38 PM; Lifecycle Status: Active; Minimum Order: 1; Mounting Type: Surface Mount, MLCC; Operating Temperature: -55°C ~ 125°C; Package / Case: 0402 (1005 Metric); packaging: TapeAndReel; partid: 1731; Part Status: Active; price: 0.01; Ratings: AEC-Q200; series: ESD SMD Auto X7R; Size / Dimension: 0.039" L x 0.020" W (1.00mm x 0.50mm); Supplier 1: DigiKey; Supplier Part Number 1: 399-17167-1-ND; Temperature Coefficient: X7R; Thickness (Max): 0.022" (0.55mm); Tolerance: ±10%; value: 0.1 µF; Voltage - Rated: 16V
IC10 = W25Q128JVPIQ_TR: Integrated Circuit; Manufacturer_Name: Winbond; Manufacturer_Part_Number: W25Q128JVPIQ TR; Datasheet Link: https://www.winbond.com/resource-files/w25q128jv%20revf%2003272018%20plus.pdf; Height: 0.8mm; Mouser Part Number: 454-W25Q128JVPIQTR; Mouser Price/Stock: https://www.mouser.co.uk/ProductDetail/Winbond/W25Q128JVPIQ-TR?qs=qSfuJ%252Bfl%2Fd6H7vbXyrDu3w%3D%3D; Arrow Part Number: W25Q128JVPIQ TR; Arrow Price/Stock: https://www.arrow.com/en/products/w25q128jvpiqtr/winbond-electronics?utm_currency=USD&region=nac

## Nets that join several sheets
+1V2: uC (10 pins), Power (C42.2 R20.2 U11.1)
+3V3: CANbus (C1.1 IC1.3), uC (21 pins), JTAG (R3.2 R12#1.2 U1.6 U2.6), Connector (5 pins), Power (8 pins), PeripheralConnector (J8.1 R29.2 R32.2 R35.2), EXTADC (C79.2 IC4.10), EnDat (9 pins), FaultDet (12 pins), Flash (C80.1 IC10.3 IC10.7 IC10.8)
+3V3A: uC (6 pins), Power (C78.2 IC11.6 R22.2 R76.1), MotorConnector (R78.2), EXTADC (C55.2 IC4.7)
+5V: Power (13 pins), MotorConnector (J6.3 J6.4)
+12V: Connector (D5.1 J2.14 J2.16), Power (5 pins)
+24V: Power (6 pins), PowerConnector (5 pins)
CHASSIS: Schematic (19 pins), Connector (J2.S1 J2.S2), PowerConnector (J5.5 J5.6), CANConnector (J4.10 J4.11), MotorConnector (J6.MP1 J6.MP2), PeripheralConnector (8 pins)
GND: Schematic (11 pins), CANbus (C1.2 C2.1 D1.3 IC1.2), uC (51 pins), JTAG (8 pins), Connector (17 pins), Power (32 pins), PowerConnector (8 pins), CANConnector (5 pins), MotorConnector (C50.1 J6.1 J6.2 R25.1), PeripheralConnector (8 pins), EXTADC (6 pins), EnDat (10 pins), FaultDet (13 pins), Flash (C80.2 IC10.4 IC10.9)
ADC0: uC (IC2.M7), PeripheralConnector (C51.2 R28.1)
ADC_CLK: uC (IC2.G6), EXTADC (IC4.13)
ADC_CS: uC (IC2.H6), EXTADC (IC4.11)
ADC_MISO: uC (IC2.G5), EXTADC (IC4.12)
ADC_MOSI: uC (IC2.G4), EXTADC (IC4.14)
CAN_N: CANbus (FL1.1), CANConnector (J4.1)
CAN_P: CANbus (FL1.4), CANConnector (J4.2)
CAN_RX: CANbus (IC1.1), uC (IC2.H11)
CAN_TX: CANbus (IC1.4), uC (IC2.H10)
CLK+: MotorConnector (J6.10), EnDat (C60.2 R30.2 R44.2)
CLK-: MotorConnector (J6.9), EnDat (C62.1 R30.1 R49.2)
DAT+: MotorConnector (J6.8), EnDat (C57.2 R38.2 R40.2)
DAT-: MotorConnector (J6.7), EnDat (C59.1 R40.1 R43.2)
ENC_CLK: uC (IC2.F1), EnDat (IC6.4 R48.1)
ENC_ENDAT: uC (IC2.G1), EnDat (IC5.2 IC5.3 R41.2)
ENC_MISO: uC (IC2.G3), EnDat (IC5.1 R39.1)
ENC_MOSI: uC (IC2.K4), EnDat (IC5.4 R42.2)
EXT_FAULT: uC (IC2.B4), FaultDet (IC7.1 IC8.5)
EXT_FAULT_1: CANConnector (J4.6), FaultDet (R60.1 R62.1)
EXT_FAULT_2: CANConnector (J4.8), FaultDet (R61.1 R64.1)
FAULT_RST: uC (IC2.B3), FaultDet (IC7.3 IC7.7 IC7.11 IC7.15)
FLASH_CLK: uC (IC2.F12), Flash (IC10.6)
FLASH_CS: uC (IC2.F11), Flash (IC10.1)
FLASH_MISO: uC (IC2.F10), Flash (IC10.2)
FLASH_MOSI: uC (IC2.L9), Flash (IC10.5)
M_TEMP: MotorConnector (C50.2 R24.1), EXTADC (IC4.6)
MCU_RXD: uC (IC2.M6), JTAG (J1.12 U2.1)
MCU_TCK: uC (IC2.M10), JTAG (J1.4 U1.4)
MCU_TDI: uC (IC2.N9), JTAG (J1.8 U1.1)
MCU_TDO: uC (IC2.M9), JTAG (J1.6 U1.2)
MCU_TMS: uC (IC2.N10), JTAG (J1.2 R3.1 U1.5)
MCU_TXD: uC (IC2.N6), JTAG (J1.14 U2.2)
OE: uC (IC2.A5), FaultDet (U13.2)
~{PG}: uC (IC2.G2), Connector (J2.18 U6.6)
TEMP1: PeripheralConnector (C82.2 R31.1), EXTADC (IC4.5)
TEMP2: PeripheralConnector (C83.2 R34.1), EXTADC (IC4.4)
TEMP3: PeripheralConnector (C84.2 R37.1), EXTADC (IC4.3)
U_A_IN: uC (IC2.B1), Connector (J2.11 U4.1)
U_B_IN: uC (IC2.C1), Connector (J2.09 U3.4)
U_EN: Connector (6 pins), FaultDet (U13.4)
U_HALL_N: uC (FB2.2), Connector (J2.05 U3.6)
U_HALL_P: uC (FB1.2), Connector (J2.01 U3.3)
U_LATCHED: uC (IC2.A2), FaultDet (IC7.13 IC8.1)
U_OC: Connector (J2.03 U3.1), FaultDet (R56.1)
U_TEMP: Connector (J2.13 U4.6), EXTADC (IC4.15)
V_A_IN: uC (IC2.E1), Connector (J2.39 U5.1)
V_B_IN: uC (IC2.E2), Connector (J2.37 U5.3)
V_HALL_N: uC (FB4.2), Connector (J2.29 U4.4)
V_HALL_P: uC (FB3.2), Connector (J2.33 U5.5)
V_LATCHED: uC (IC2.A3), FaultDet (IC7.9 IC8.2)
V_OC: Connector (J2.31 U5.6), FaultDet (R57.1)
V_SENSE_N: uC (IC2.K5), Connector (C52.1 R55.1)
V_SENSE_P: uC (IC2.J5), Connector (C52.2 R54.1)
V_TEMP: Connector (J2.27 U4.5), EXTADC (IC4.16)
W_A_IN: uC (IC2.D2), Connector (J2.30 U6.5)
W_B_IN: uC (IC2.F2), Connector (J2.32 U7.6)
W_HALL_N: uC (FB6.2), Connector (J2.40 U7.1)
W_HALL_P: uC (FB5.2), Connector (J2.36 U7.4)
W_LATCHED: uC (IC2.A4), FaultDet (IC7.10 IC8.4)
W_OC: Connector (J2.38 U7.3), FaultDet (R58.1)
W_TEMP: Connector (J2.28 U4.3), EXTADC (IC4.1)

## Assembly variants
MY26 HV Inverter Logic Board w/out chassis-ground jumpers: not fitted R66 R67 R68 R69 R70 R71 R72 R73 R74 R75 R77